# EAGLE design Sensor (EAGLE 9.5.2)
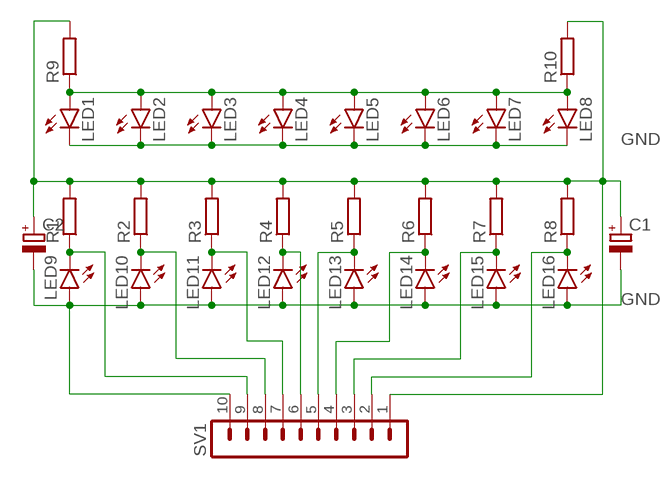
[diagram p0: schematic, sheet 1]

## Parts
C1  CPOL-EUE2-4  [E2-4]
C2  CPOL-EUE2-4  [E2-4]
LED1  LED5MM  [LED5MM]
LED2  LED5MM  [LED5MM]
LED3  LED5MM  [LED5MM]
LED4  LED5MM  [LED5MM]
LED5  LED5MM  [LED5MM]
LED6  LED5MM  [LED5MM]
LED7  LED5MM  [LED5MM]
LED8  LED5MM  [LED5MM]
LED9  LED5MM  [LED5MM]
LED10  LED5MM  [LED5MM]
LED11  LED5MM  [LED5MM]
LED12  LED5MM  [LED5MM]
LED13  LED5MM  [LED5MM]
LED14  LED5MM  [LED5MM]
LED15  LED5MM  [LED5MM]
LED16  LED5MM  [LED5MM]
R1  R-EU_0309/10  [0309/10]
R2  R-EU_0309/10  [0309/10]
R3  R-EU_0309/10  [0309/10]
R4  R-EU_0309/10  [0309/10]
R5  R-EU_0309/10  [0309/10]
R6  R-EU_0309/10  [0309/10]
R7  R-EU_0309/10  [0309/10]
R8  R-EU_0309/10  [0309/10]
R9  R-EU_0309/10  [0309/10]
R10  R-EU_0309/10  [0309/10]
SV1  MA10-1  [MA10-1]

## Nets
GND: C1.- C2.- LED1.K(C) LED2.K(C) LED3.K(C) LED4.K(C) LED5.K(C) LED6.K(C) LED7.K(C) LED8.K(C) LED9.A LED10.A LED11.A LED12.A LED13.A LED14.A LED15.A LED16.A SV1.10
N$1: LED9.K(C) R1.1 SV1.9
N$2: LED10.K(C) R2.1 SV1.8
N$3: LED11.K(C) R3.1 SV1.7
N$4: LED12.K(C) R4.1 SV1.6
N$5: LED13.K(C) R5.1 SV1.5
N$6: LED14.K(C) R6.1 SV1.4
N$7: LED15.K(C) R7.1 SV1.3
N$8: LED16.K(C) R8.1 SV1.2
N$9: LED1.A LED2.A LED3.A LED4.A LED5.A LED6.A LED7.A LED8.A R9.1 R10.1
N$13: C1.+ C2.+ R1.2 R2.2 R3.2 R4.2 R5.2 R6.2 R7.2 R8.2 R9.2 R10.2 SV1.1

## Library data of the parts
C1 C2 = rcl:CPOL-EU: POLARIZED CAPACITOR, European symbol; SPICEPREFIX: C
LED1-LED16 = led:LED: LED OSRAM: - CHIPLED LG R971, LG N971, LY N971, LG Q971, LY Q971, LO R971, LY R971 LH N974, LH R974 LS Q976, LO Q976, LY Q976 LO Q996 - Hyper CHIPLED LW Q18S LB Q993, LB Q99A, LB R99A - SideLED LS A670, LO A670, LY A670, LG A670, LP A670 LB A673, LV A673, LT A673, LW A673 LH A674 LY A675 LS A676, LA A676, LO A676, LY A676, LW A676 LS A679, LY A679, LG A679 - Hyper Micro SIDELED® LS Y876, LA Y876, LO Y876, LY Y876 LT Y87S - SmartLED LW L88C, LW L88S LB L89C, LB L89S, LG L890 LS L89K, LO L89K, LY L89K LS L896, LA L896, LO L896, LY L896 - TOPLED LS T670, LO T670, LY T670, LG T670, LP T670 LSG T670, LSP T670, LSY T670, LOP T670, LYG T670 LG T671, LOG T671, LSG T671 LB T673, LV T673, LT T673, LW T673 LH T674 LS T676, LA T676, LO T676, LY T676, LB T676, LH T676, LSB T676, LW T676 LB T67C, LV T67C, LT T67C, LS T67K, LO T67K, LY T67K, LW E67C LS E67B, LA E67B, LO E67B, LY E67B, LB E67C, LV E67C, LT E67C LW T67C LS T679, LY T679, LG T679 LS T770, LO T770, LY T770, LG T770, LP T770 LB T773, LV T773, LT T773, LW T773 LH T774 LS E675, LA E675, LY E675, LS T675 LS T776, LA T776, LO T776, LY T776, LB T776 LHGB T686 LT T68C, LB T68C - Hyper Mini TOPLED® LB M676 - Mini TOPLED Santana® LG M470 LS M47K, LO M47K, LY M47K Source: http://www.osram.convergy.de LUXEON: - LUMILED® LXK2-PW12-R00, LXK2-PW12-S00, LXK2-PW14-U00, LXK2-PW14-V00 LXK2-PM12-R00, LXK2-PM12-S00, LXK2-PM14-U00 LXK2-PE12-Q00, LXK2-PE12-R00, LXK2-PE12-S00, LXK2-PE14-T00, LXK2-PE14-U00 LXK2-PB12-K00, LXK2-PB12-L00, LXK2-PB12-M00, LXK2-PB14-N00, LXK2-PB14-P00, LXK2-PB14-Q00 LXK2-PR12-L00, LXK2-PR12-M00, LXK2-PR14-Q00, LXK2-PR14-R00 LXK2-PD12-Q00, LXK2-PD12-R00, LXK2-PD12-S00 LXK2-PH12-R00, LXK2-PH12-S00 LXK2-PL12-P00, LXK2-PL12-Q00, LXK2-PL12-R00 Source: www.luxeon.com KINGBRIGHT: KA-3528ASYC Source: www.kingbright.com
R1-R10 = rcl:R-EU_: RESISTOR, European symbol; SPICEPREFIX: R
SV1 = con-lstb:MA10-1: PIN HEADER; OC_FARNELL: unknown; OC_NEWARK: unknown

## Board
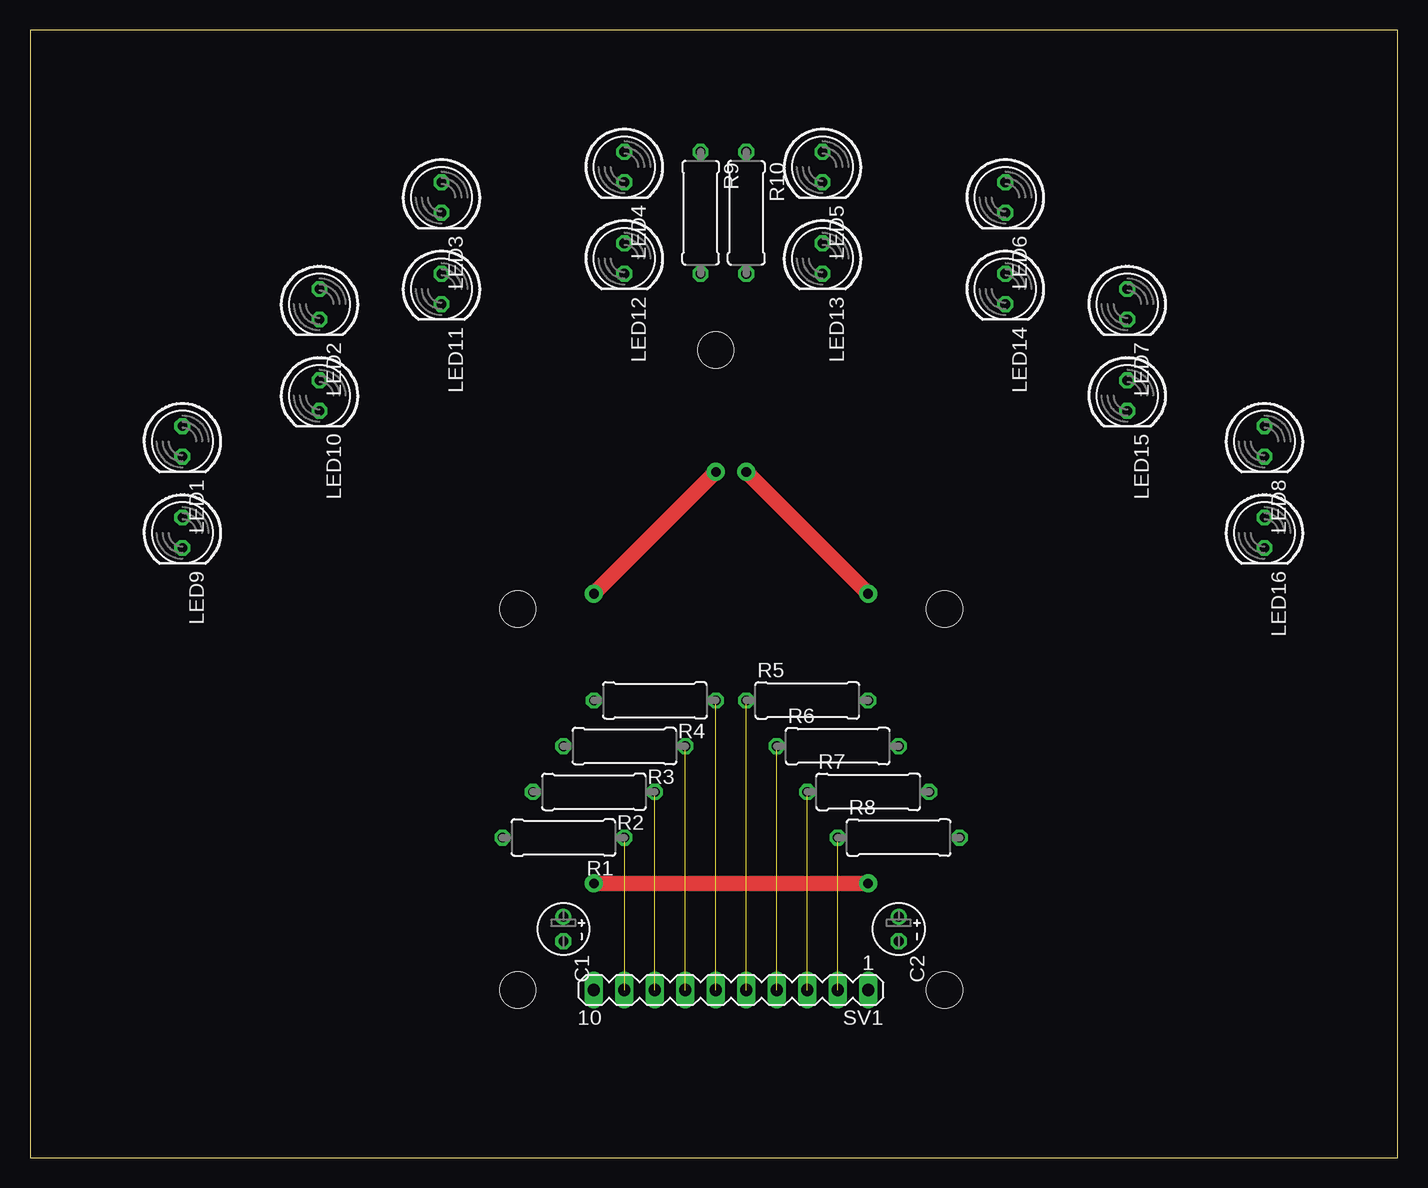
[diagram p1: board, top side]
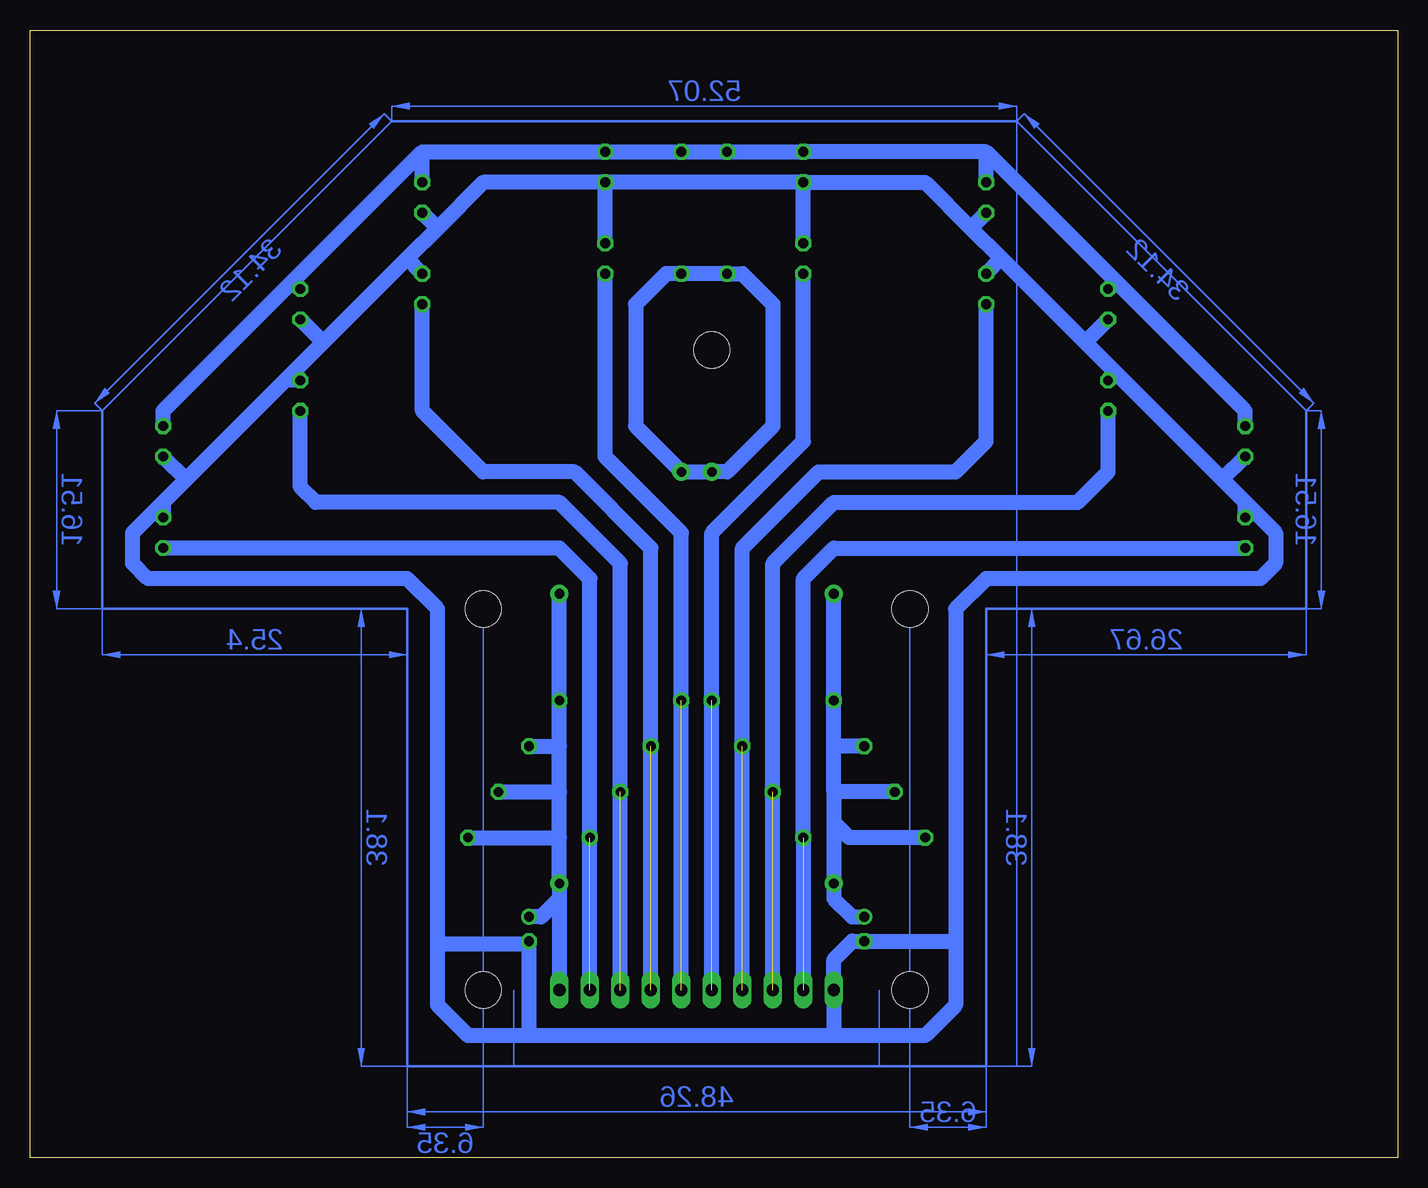
[diagram p2: board, bottom side, seen from below]

Size 113.97 x 93.97 mm. Coordinates in mm from the lower left corner, seen from the top.
Outline: 0,0 113.97,0 113.97,93.97 0,93.97 0,0
Copper layers (1*16): Top 0.035mm / dielectric 1.5mm / Bottom 0.035mm
Design rules "default": minimum track width 6mil, minimum drill 0.35mm, track to track 6mil, track to pad 6mil, pad to pad 6mil, via to via 6mil, smd to smd 6mil, copper to edge 40mil, drill to drill 6mil, minimum pad ring 10mil, minimum via ring 8mil, stop-mask expansion 4mil, vias tented up to drill 0mil, thermal gap 10mil
Holes 3 mm at 40.64,13.97 76.2,13.97 40.64,45.72 76.2,45.72 57.15,67.31

### Footprints (pad centres in the part's own frame; a part is rotated, then mirrored left to right if it is on the bottom)
E2-4 = drill 0.813 pad 1.27: + -1.016,0 | drill 0.813 pad 1.27 octagon: - 1.016,0
LED5MM = drill 0.813 octagon: A -1.27,0; K 1.27,0
0309/10 = drill 0.813 octagon: 1 -5.08,0; 2 5.08,0
MA10-1 = drill 1.016 long: 1 -11.43,0; 2 -8.89,0; 3 -6.35,0; 4 -3.81,0; 5 -1.27,0; 6 1.27,0; 7 3.81,0; 8 6.35,0; 9 8.89,0; 10 11.43,0

### Placement (x,y rotation side)
C1  44.45,19.05 270 top
C2  72.39,19.05 270 top
LED1  12.7,59.69 270 top
LED2  24.13,71.12 270 top
LED3  34.29,80.01 270 top
LED4  49.53,82.55 270 top
LED5  66.04,82.55 270 top
LED6  81.28,80.01 270 top
LED7  91.44,71.12 270 top
LED8  102.87,59.69 270 top
LED9  12.7,52.07 270 top
LED10  24.13,63.5 270 top
LED11  34.29,72.39 270 top
LED12  49.53,74.93 270 top
LED13  66.04,74.93 270 top
LED14  81.28,72.39 270 top
LED15  91.44,63.5 270 top
LED16  102.87,52.07 270 top
R1  44.45,26.67 180 top
R2  46.99,30.48 180 top
R3  49.53,34.29 180 top
R4  52.07,38.1 180 top
R5  64.77,38.1 0 top
R6  67.31,34.29 0 top
R7  69.85,30.48 0 top
R8  72.39,26.67 0 top
R9  55.88,78.74 270 top
R10  59.69,78.74 270 top
SV1  58.42,13.97 180 top

### Tracks (layer width: path | path; a pad name or v marks a point on that pad's centre or on a via)
GND
  Bottom 1.27: LED4.K LED5.K | LED5.K 76.2,81.28 80.01,77.47 | 80.01,77.47 82.55,74.93 | 82.55,74.93 89.54,67.95 | 35.56,77.47 39.37,81.28 LED4.K | 35.56,77.47 33.02,74.93 | 33.02,74.93 26.04,67.95 | 26.04,67.95 23.5,65.41 | 23.5,65.41 14.61,56.52 | 14.61,56.52 12.7,54.61 | LED2.K 26.04,67.95 | LED3.K 35.56,77.47 | LED6.K 80.01,77.47 | LED7.K 89.54,67.95 | LED9.A 12.7,54.61 | 102.87,54.61 LED16.A | 89.54,67.95 92.71,64.77 | 92.71,64.77 100.97,56.52 | 100.97,56.52 102.87,54.61 | LED1.K 14.61,56.52 | LED10.A 23.5,65.41 | LED11.A 33.02,74.93 | LED12.A LED4.K | LED13.A LED5.K | LED14.A 82.55,74.93 | LED15.A 92.71,64.77 | LED8.K 100.97,56.52 | 12.7,54.61 10.16,52.07 10.16,49.53 11.43,48.26 34.29,48.26 36.83,45.72 36.83,17.78 | 46.99,10.16 39.37,10.16 36.83,12.7 36.83,17.78 | 46.99,10.16 72.39,10.16 | 72.39,10.16 77.47,10.16 80.01,12.7 80.01,17.78 | 102.87,54.61 105.41,52.07 105.41,49.53 104.14,48.26 82.55,48.26 80.01,45.72 80.01,17.78 | 46.99,10.16 SV1.10 46.99,16.51 45.47,18.03 C1.- 37.08,18.03 36.83,17.78 | 72.39,10.16 C2.- 72.64,17.78 80.01,17.78
N$1  (1 unrouted)
  Bottom 1.27: SV1.9 R1.1 49.53,48.26 46.99,50.8 LED9.K
N$2  (1 unrouted)
  Bottom 1.27: LED10.K 24.13,57.15 26.67,54.61 46.99,54.61 52.07,49.53 R2.1 SV1.8
N$3  (1 unrouted)
  Bottom 1.27: SV1.7 R3.1 54.61,50.8 48.26,57.15 36.83,57.15 34.29,59.69 LED11.K
N$4  (1 unrouted)
  Bottom 1.27: SV1.6 R4.1 57.15,52.07 49.53,59.69 LED12.K
N$5  (1 unrouted)
  Bottom 1.27: SV1.5 R5.1 59.69,52.07 66.04,58.42 LED13.K
N$6  (1 unrouted)
  Bottom 1.27: SV1.4 R6.1 62.23,50.8 68.58,57.15 76.2,57.15 81.28,62.23 LED14.K
N$7  (1 unrouted)
  Bottom 1.27: SV1.3 R7.1 64.77,49.53 69.85,54.61 90.17,54.61 91.44,55.88 LED15.K
N$8  (1 unrouted)
  Bottom 1.27: SV1.2 R8.1 67.31,48.26 69.85,50.8 LED16.K
N$9
  Bottom 1.27: LED1.A 12.7,62.23 23.5,73.03 | 23.5,73.03 34.29,83.82 | 34.29,83.82 LED4.A R9.1 R10.1 LED5.A 81.28,83.82 | LED8.A 102.87,62.23 92.08,73.03 | 92.08,73.03 81.28,83.82 | LED2.A 23.5,73.03 | LED3.A 34.29,83.82 | LED6.A 81.28,83.82 | LED7.A 92.08,73.03
N$10
  Bottom 0.2: 31.75,86.36 7.62,62.23 7.62,45.72 34.29,45.72 34.29,7.62 82.55,7.62 82.55,45.72 107.95,45.72 107.95,62.23 83.82,86.36 31.75,86.36
N$13  (via drill 0.8 pad 1.5)
  Top 1.27: v46.99,22.86 v69.85,22.86 | v46.99,46.99 v57.15,57.15 | v69.85,46.99 v59.69,57.15
  Bottom 1.27: 69.85,26.67 v69.85,22.86 69.85,21.59 | 69.85,26.67 69.85,30.48 | 69.85,30.48 69.85,34.29 | 69.85,34.29 R5.2 v69.85,46.99 | R1.2 45.72,26.67 46.99,27.94 | 46.99,30.48 46.99,27.94 | 46.99,30.48 46.99,34.29 | 46.99,34.29 R4.2 v46.99,46.99 | R3.2 46.99,34.29 | R2.2 46.99,30.48 | R8.2 69.85,26.67 | R7.2 69.85,30.48 | R6.2 69.85,34.29 | 46.99,27.94 v46.99,22.86 46.99,21.59 45.47,20.07 C1.+ | 69.85,21.59 SV1.1 | C2.+ 71.37,20.07 69.85,21.59 | v59.69,57.15 v57.15,57.15 55.88,57.15 52.07,60.96 52.07,71.12 54.61,73.66 R9.2 R10.2 60.96,73.66 63.5,71.12 63.5,60.96 v59.69,57.15
(copper drawn outside any net)
  shapes: Bottom area x15